# EAGLE design nrflpc (EAGLE 6.4)
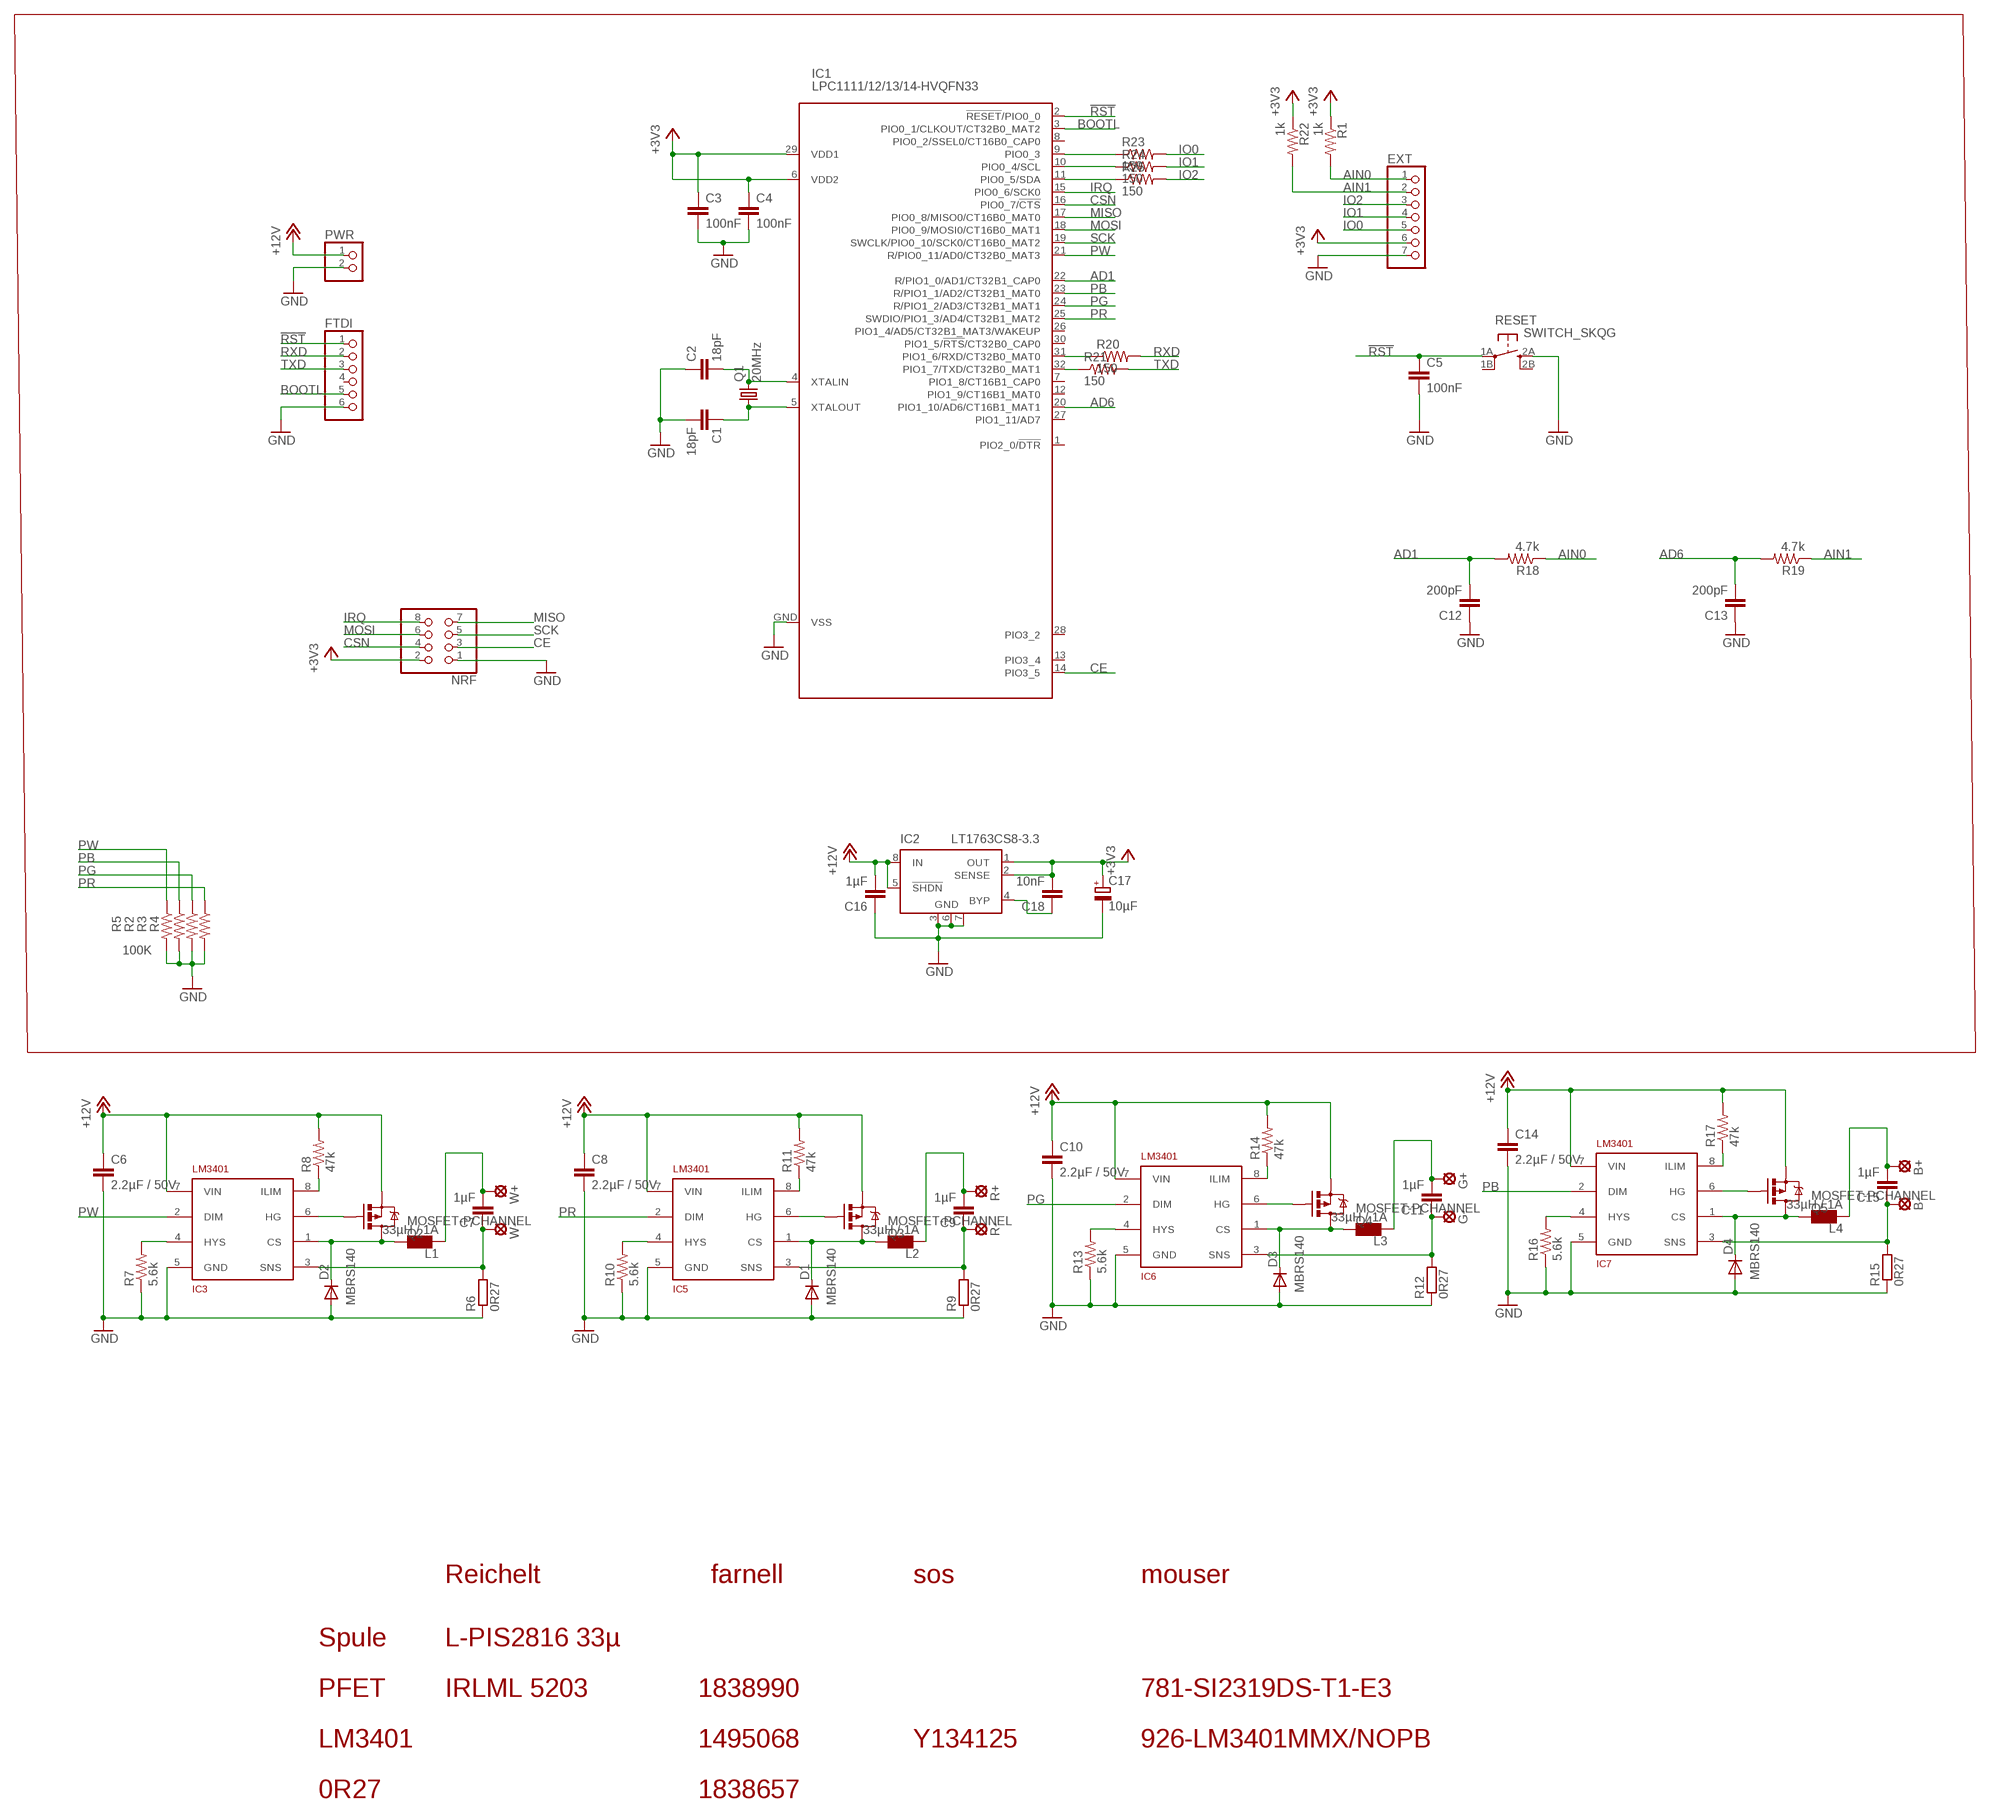
[diagram p0: schematic, sheet 1]

## Parts
B+  SE14  [SE14]
B-  SE14  [SE14]
C1  18pF  CAP0402-CAP  [0402-CAP]
C2  18pF  CAP0402-CAP  [0402-CAP]
C3  100nF  CAP0402-CAP  [0402-CAP]
C4  100nF  CAP0402-CAP  [0402-CAP]
C5  100nF  CAP0402-CAP  [0402-CAP]
C6  2.2µF / 50V  C-EUC1210  [C1210]
C7  1µF  CAP0805  [0805]
C8  2.2µF / 50V  C-EUC1210  [C1210]
C9  1µF  CAP0805  [0805]
C10  2.2µF / 50V  C-EUC1210  [C1210]
C11  1µF  CAP0805  [0805]
C12  200pF  CAP0402-CAP  [0402-CAP]
C13  200pF  CAP0402-CAP  [0402-CAP]
C14  2.2µF / 50V  C-EUC1210  [C1210]
C15  1µF  CAP0805  [0805]
C16  1µF  CAP0805  [0805]
C17  10µF  CPOL-EUSMCA  [SMC_A]
C18  10nF  CAP0402-CAP  [0402-CAP]
D1  MBRS140  DIODE-SMB  [SMB]
D2  MBRS140  DIODE-SMB  [SMB]
D3  MBRS140  DIODE-SMB  [SMB]
D4  MBRS140  DIODE-SMB  [SMB]
EXT  PINHD-1X7  [1X07]
FTDI  PINHD-1X6  [1X06]
G+  SE14  [SE14]
G-  SE14  [SE14]
IC1  LPC1111/12/13/14-HVQFN33  [HVQFN33]
IC2  LT1763CS8-3.3  [SOIC8]
IC3  LM3401  [MSOP8]
IC5  LM3401  [MSOP8]
IC6  LM3401  [MSOP8]
IC7  LM3401  [MSOP8]
L1  33µH / 1A  L_PIS2816  [PIS2816]
L2  33µH / 1A  L_PIS2816  [PIS2816]
L3  33µH / 1A  L_PIS2816  [PIS2816]
L4  33µH / 1A  L_PIS2816  [PIS2816]
NRF  PINHD-2X4  [2X04]
PWR  PINHD-1X2  [1X02]
Q1  20MHz  MT-OSCILLATOR  [MT]
Q2  MOSFET-PCHANNEL  [SOT23]
Q3  MOSFET-PCHANNEL  [SOT23]
Q4  MOSFET-PCHANNEL  [SOT23]
Q5  MOSFET-PCHANNEL  [SOT23]
R1  1k  RESISTOR0402-RES  [0402-RES]
R2  100K  RESISTOR0402-RES  [0402-RES]
R3  100K  RESISTOR0402-RES  [0402-RES]
R4  100K  RESISTOR0402-RES  [0402-RES]
R5  100K  RESISTOR0402-RES  [0402-RES]
R6  0R27  R-EU_R1206  [R1206]
R7  5.6k  RESISTOR0805-RES  [0805]
R8  47k  RESISTOR0805-RES  [0805]
R9  0R27  R-EU_R1206  [R1206]
R10  5.6k  RESISTOR0805-RES  [0805]
R11  47k  RESISTOR0805-RES  [0805]
R12  0R27  R-EU_R1206  [R1206]
R13  5.6k  RESISTOR0805-RES  [0805]
R14  47k  RESISTOR0805-RES  [0805]
R15  0R27  R-EU_R1206  [R1206]
R16  5.6k  RESISTOR0805-RES  [0805]
R17  47k  RESISTOR0805-RES  [0805]
R18  4.7k  RESISTOR0402-RES  [0402-RES]
R19  4.7k  RESISTOR0402-RES  [0402-RES]
R20  150  RESISTOR0402-RES  [0402-RES]
R21  150  RESISTOR0402-RES  [0402-RES]
R22  1k  RESISTOR0402-RES  [0402-RES]
R23  150  RESISTOR0402-RES  [0402-RES]
R24  150  RESISTOR0402-RES  [0402-RES]
R25  150  RESISTOR0402-RES  [0402-RES]
R+  SE14  [SE14]
R-  SE14  [SE14]
RESET  SWITCH_SKQG  [SWITCH_SKQG]
W+  SE14  [SE14]
W-  SE14  [SE14]

## Nets
!RST: C5.1 FTDI.1 IC1.2(!RESET!/PIO0_0) RESET.1A
+3V3: C3.1 C4.1 C17.+ C18.2 EXT.6 IC1.6(VDD2) IC1.29(VDD1) IC2.1(OUT) IC2.2(SENSE) NRF.2 R1.1 R22.1
+12V: C6.1 C8.1 C10.1 C14.1 C16.2 IC2.5(!SHDN) IC2.8(IN) IC3.7(VIN) IC5.7(VIN) IC6.7(VIN) IC7.7(VIN) PWR.1 Q2.2(S) Q3.2(S) Q4.2(S) Q5.2(S) R8.2 R11.2 R14.2 R17.2
AD1: C12.2 IC1.22(R/PIO1_0/AD1/CT32B1_CAP0) R18.2
AD6: C13.2 IC1.20(PIO1_10/AD6/CT16B1_MAT1) R19.2
AIN0: EXT.1 R1.2 R18.1
AIN1: EXT.2 R19.1 R22.2
BOOTL: FTDI.5 IC1.3(PIO0_1/CLKOUT/CT32B0_MAT2)
CE: IC1.14(PIO3_5) NRF.3
CSN: IC1.16(PIO0_7/!CTS!) NRF.4
GND: C1.2 C2.1 C3.2 C4.2 C5.2 C6.2 C8.2 C10.2 C12.1 C13.1 C14.2 C16.1 C17.- D1.A D2.A D3.A D4.A EXT.7 FTDI.6 IC1.GND(VSS) IC2.3(GND) IC2.6(GND) IC2.7(GND) IC3.5(GND) IC5.5(GND) IC6.5(GND) IC7.5(GND) NRF.1 PWR.2 R2.2 R3.2 R4.2 R5.2 R6.1 R7.1 R9.1 R10.1 R12.1 R13.1 R15.1 R16.1 RESET.2A
IO0: EXT.5 R23.2
IO1: EXT.4 R24.2
IO2: EXT.3 R25.2
IRQ: IC1.15(PIO0_6/SCK0) NRF.8
MISO: IC1.17(PIO0_8/MISO0/CT16B0_MAT0) NRF.7
MOSI: IC1.18(PIO0_9/MOSI0/CT16B0_MAT1) NRF.6
N$1: C7.1 IC3.3(SNS) R6.2 W-.MP
N$2: C7.2 L1.P$2 W+.MP
N$3: D2.C IC3.1(CS) L1.P$1 Q2.3(D)
N$4: C9.1 IC5.3(SNS) R9.2 R-.MP
N$5: IC3.4(HYS) R7.2
N$6: C9.2 L2.P$2 R+.MP
N$7: IC3.8(ILIM) R8.1
N$8: D1.C IC5.1(CS) L2.P$1 Q3.3(D)
N$9: IC5.4(HYS) R10.2
N$10: IC3.6(HG) Q2.1(G)
N$11: IC5.8(ILIM) R11.1
N$12: IC5.6(HG) Q3.1(G)
N$13: C11.1 G-.MP IC6.3(SNS) R12.2
N$14: C11.2 G+.MP L3.P$2
N$15: D3.C IC6.1(CS) L3.P$1 Q4.3(D)
N$16: IC6.4(HYS) R13.2
N$17: IC6.8(ILIM) R14.1
N$18: C18.1 IC2.4(BYP)
N$19: C2.2 IC1.4(XTALIN) Q1.3
N$20: IC6.6(HG) Q4.1(G)
N$21: B-.MP C15.1 IC7.3(SNS) R15.2
N$22: B+.MP C15.2 L4.P$2
N$23: D4.C IC7.1(CS) L4.P$1 Q5.3(D)
N$24: IC7.4(HYS) R16.2
N$25: IC7.8(ILIM) R17.1
N$26: IC7.6(HG) Q5.1(G)
N$27: IC1.31(PIO1_6/RXD/CT32B0_MAT0) R20.1
N$29: C1.1 IC1.5(XTALOUT) Q1.1
N$30: IC1.32(PIO1_7/TXD/CT32B0_MAT1) R21.1
N$34: IC1.9(PIO0_3) R23.1
N$35: IC1.10(PIO0_4/SCL) R24.1
N$36: IC1.11(PIO0_5/SDA) R25.1
PB: IC1.23(R/PIO1_1/AD2/CT32B1_MAT0) IC7.2(DIM) R2.1
PG: IC1.24(R/PIO1_2/AD3/CT32B1_MAT1) IC6.2(DIM) R3.1
PR: IC1.25(SWDIO/PIO1_3/AD4/CT32B1_MAT2) IC5.2(DIM) R4.1
PW: IC1.21(R/PIO0_11/AD0/CT32B0_MAT3) IC3.2(DIM) R5.1
RXD: FTDI.2 R20.2
SCK: IC1.19(SWCLK/PIO0_10/SCK0/CT16B0_MAT2) NRF.5
TXD: FTDI.3 R21.2
Unconnected: FTDI.4 IC1.1(PIO2_0/!DTR!) IC1.7(PIO1_8/CT16B1_CAP0) IC1.8(PIO0_2/SSEL0/CT16B0_CAP0) IC1.12(PIO1_9/CT16B1_MAT0) IC1.13(PIO3_4) IC1.26(PIO1_4/AD5/CT32B1_MAT3/WAKEUP) IC1.27(PIO1_11/AD7) IC1.28(PIO3_2) IC1.30(PIO1_5/!RTS!/CT32B0_CAP0) RESET.1B RESET.2B

## Notes on the sheet
- Reichelt | farnell | sos | mouser
- Spule | L-PIS2816 33µ
- PFET | IRLML 5203 | 1838990 | 781-SI2319DS-T1-E3
- LM3401 | 1495068 | Y134125 | 926-LM3401MMX/NOPB
- 0R27 | 1838657

## Library data of the parts
B+ B- G+ G- R+ R- W+ W- = solpad:SE14: SOLDER PAD E1553, drill 1,4mm, distributor Buerklin, 07F820
C1-C5 C12 C13 = SparkFun-Passives:CAP: Capacitor Standard 0603 ceramic capacitor, and 0.1" leaded capacitor.
C6 C8 C10 C14 = rcl:C-EU: CAPACITOR, European symbol
C7 C9 C11 C15 C16 C18 = SparkFun:CAP: Capacitor Standard 0603 ceramic capacitor, and 0.1" leaded capacitor.
C17 = rcl:CPOL-EU: POLARIZED CAPACITOR, European symbol
D1-D4 = diode:DIODE-: DIODE
EXT = pinhead:PINHD-1X7: PIN HEADER
FTDI = pinhead:PINHD-1X6: PIN HEADER
IC1 = lpc1100v1.1:LPC1111/12/13/14-HVQFN33: NXP Semiconductors LPC11xx microcontrollers <http://ics.nxp.com/products/lpc1000/lpc11xx/> ARM 32-bit Cortex-M0 Microcontroller with MPU CPU clock up to 50MHz Up to 32KByte on-chip Flash ROM with In-System Programming (ISP) and In-Application Programming (IAP) via On-Chip Bootloader Up to 8KByte SRAM Nested Vectored Interrupt Controller Up to 2 SPI controllers UART with full Modem Interface and RS485 Support Fast Mode I2C-Bus 4 Timers with 4 capture channels and 13 output channels Watchdog (WDT) Sytem tick timer 10-bit ADC with 8 channels Power Management Unit (PMU) Brownout detection 12MHz internal RC oscillator Serial Wire Debug/Trace port
IC2 = linear-technology:LT1763CS8: 500mA, Low Noise, LDO Micropower Regulators Source: http://cds.linear.com/docs/Datasheet/1763ff.pdf; MPN: LT1763CS8-3.3; OC_FARNELL: 1273617; OC_NEWARK: 57M6055
IC3 IC5-IC7 = seb:LM3401
L1-L4 = seb:L_PIS2816
NRF = pinhead:PINHD-2X4: PIN HEADER
PWR = pinhead:PINHD-1X2: PIN HEADER
Q1 = seb:MT-OSCILLATOR
Q2-Q5 = SparkFun:MOSFET-PCHANNEL
R1-R5 R18-R25 = SparkFun-Resistors:RESISTOR: Resistor Basic schematic elements and footprints for 0603, 1206, and PTH resistors.
R6 R9 R12 R15 = rcl:R-EU_: RESISTOR, European symbol
R7 R8 R10 R11 R13 R14 R16 R17 = SparkFun:RESISTOR: Resistor Basic schematic elements and footprints for 0603, 1206, and PTH resistors.
RESET = seb:SWITCH_SKQG

## Net classes
2 GND/3V3: width 0.2 mm, drill 0.4 mm

## Board
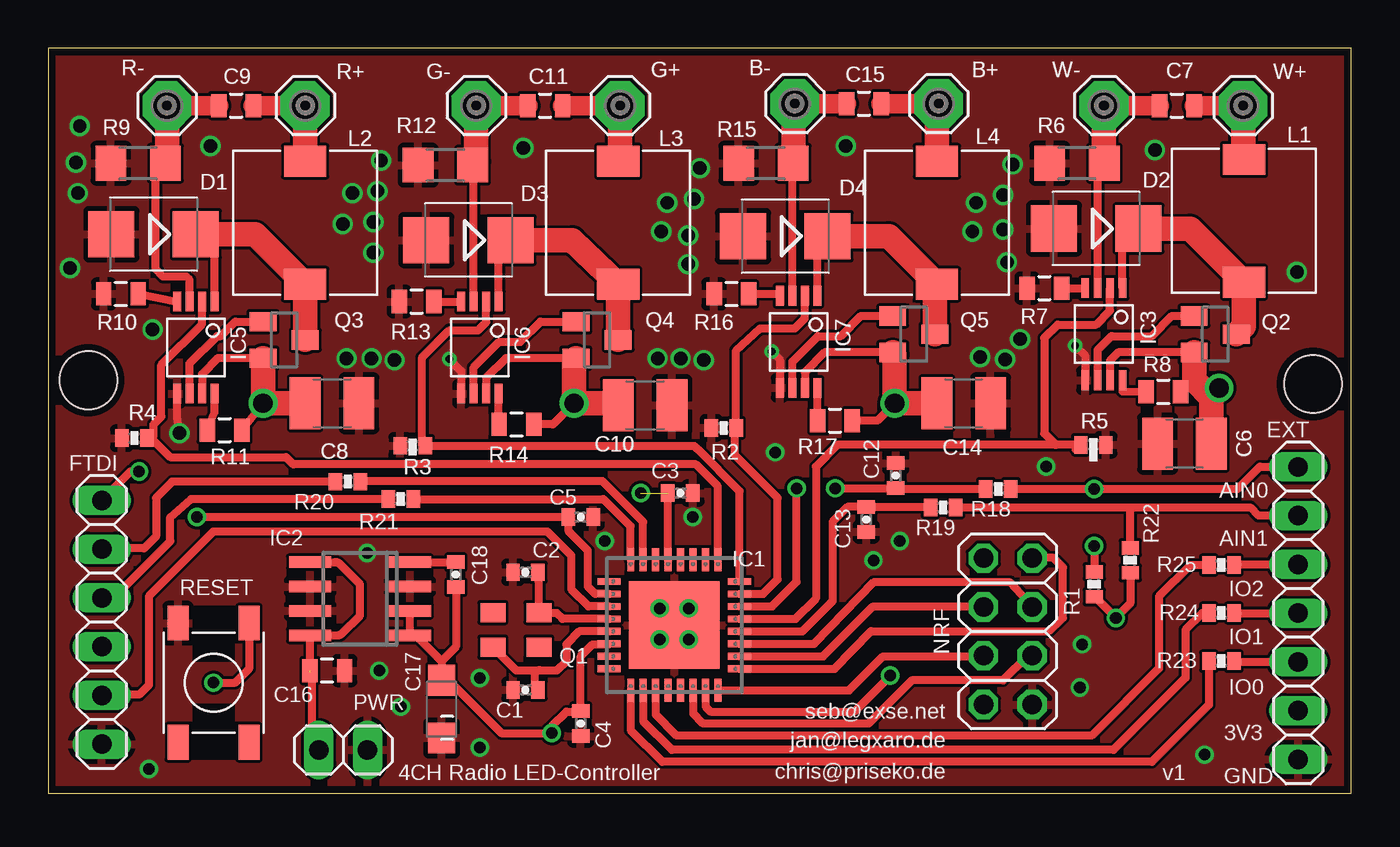
[diagram p1: board, top side]
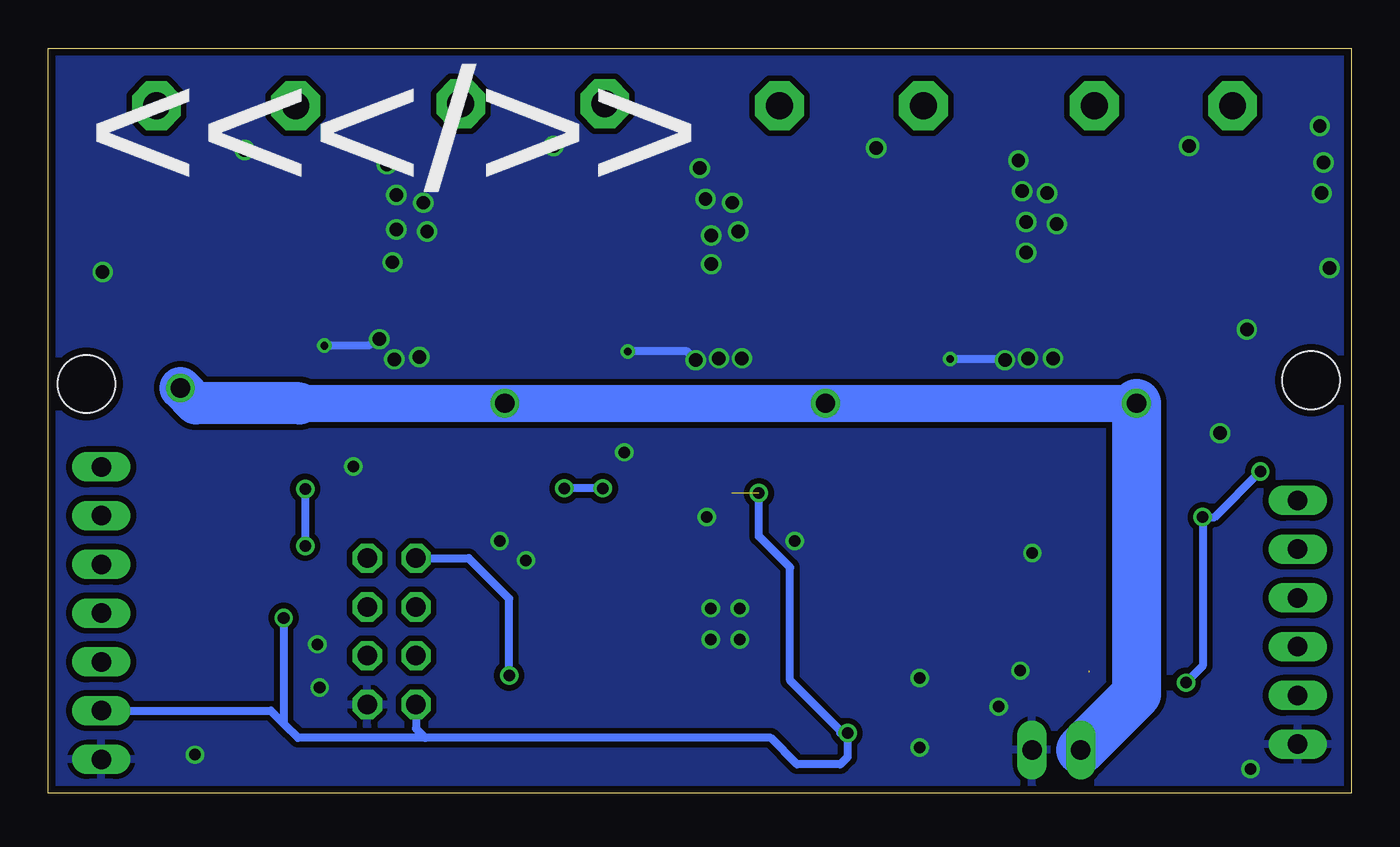
[diagram p2: board, bottom side, seen from below]

Size 67.9 x 38.8 mm. Coordinates in mm from the lower left corner, seen from the top.
Outline: 0,0 67.9,0 67.9,38.8 0,38.8 0,0
Copper layers (1*16): Top 0.0356mm / dielectric 1.5011mm / Bottom 0.0356mm
Design rules "LaenPCBOrder": minimum track width 6mil, minimum drill 13mil, track to track 6mil, track to pad 6mil, pad to pad 6mil, via to via 6mil, smd to smd 6mil, copper to edge 15mil, drill to drill 6mil, minimum pad ring 7mil, minimum via ring 7mil, stop-mask expansion 4mil, vias tented up to drill 0mil, thermal gap 10mil
Holes 3 mm at 2.1,21.5 65.9,21.3

### Footprints (pad centres in the part's own frame; a part is rotated, then mirrored left to right if it is on the bottom)
SE14 = drill 1.397 pad 2.54 octagon: MP 0,0
0402-CAP = smd 0.7 x 0.9: 1 -0.65,0; 2 0.65,0
C1210 = smd 1.6 x 2.7: 1 -1.4,0; 2 1.4,0
0805 = smd 0.8 x 1.2: 1 -0.9,0; 2 0.9,0
SMC_A = smd 1.6 x 1.4: + -1.5,0; - 1.5,0
SMB = smd 2.4 x 2.4: A 2.2,0; C -2.2,0
1X07 = drill 1.016 long: 1 -7.62,0; 2 -5.08,0; 3 -2.54,0; 4 0,0; 5 2.54,0; 6 5.08,0; 7 7.62,0
1X06 = drill 1.016 long: 1 -6.35,0; 2 -3.81,0; 3 -1.27,0; 4 1.27,0; 5 3.81,0; 6 6.35,0
HVQFN33 = smd 1.2 x 0.35: 1 -3.4,2.275; 2 -3.4,1.625; 3 -3.4,0.975; 4 -3.4,0.325; 5 -3.4,-0.325; 6 -3.4,-0.975; 7 -3.4,-1.625; 8 -3.4,-2.275; 17 3.4,-2.275; 18 3.4,-1.625; 19 3.4,-0.975; 20 3.4,-0.325; 21 3.4,0.325; 22 3.4,0.975; 23 3.4,1.625; 24 3.4,2.275 | smd 0.35 x 1.2: 9 -2.275,-3.4; 10 -1.625,-3.4; 11 -0.975,-3.4; 12 -0.325,-3.4; 13 0.325,-3.4; 14 0.975,-3.4; 15 1.625,-3.4; 16 2.275,-3.4; 25 2.275,3.4; 26 1.625,3.4; 27 0.975,3.4; 28 0.325,3.4; 29 -0.325,3.4; 30 -0.975,3.4; 31 -1.625,3.4; 32 -2.275,3.4 | smd 4.7 x 4.55: GND 0,0
SOIC8 = smd 0.6 x 2.2: 1 -1.905,-2.6; 2 -0.635,-2.6; 3 0.635,-2.6; 4 1.905,-2.6; 5 1.905,2.6; 6 0.635,2.6; 7 -0.635,2.6; 8 -1.905,2.6
MSOP8 = smd 0.41 x 1.02: 1 -0.975,-2.4; 2 -0.325,-2.4; 3 0.325,-2.4; 4 0.975,-2.4; 5 0.975,2.4; 6 0.325,2.4; 7 -0.325,2.4; 8 -0.975,2.4
PIS2816 = smd 2.2 x 1.6: P$1 0,3.2; P$2 0,-3.2
2X04 = drill 1.016 octagon: 1 -3.81,-1.27; 2 -3.81,1.27; 3 -1.27,-1.27; 4 -1.27,1.27; 5 1.27,-1.27; 6 1.27,1.27; 7 3.81,-1.27; 8 3.81,1.27
1X02 = drill 1.016 long: 1 -1.27,0; 2 1.27,0
MT = smd 1.3 x 1: 1 1.2,0.9; 2 -1.2,0.9; 3 -1.2,-0.9; 4 1.2,-0.9
SOT23 = smd 1 x 1.4: 1 -0.95,-1.1; 2 0.95,-1.1; 3 0,1.1
0402-RES = smd 0.7 x 0.9: 1 -0.65,0; 2 0.65,0
R1206 = smd 1.6 x 1.803: 1 -1.422,0; 2 1.422,0
SWITCH_SKQG = smd 1.8 x 1.1: 1A -3.1,1.85; 1B 3.1,1.85; 2A -3.1,-1.85; 2B 3.1,-1.85

### Placement (x,y rotation side)
B+  46.4,35.9 0 top
B-  38.9,35.9 0 top
C1  24.88,5.38 180 top
C2  24.88,11.5 0 top
C3  32.94,15.62 0 top
C4  27.75,3.62 270 top
C5  27.75,14.38 0 top
C6  59.2,18.2 180 top
C7  58.8,35.8 0 top
C8  14.8,20.3 0 top
C9  9.8,35.8 0 top
C10  31.1,20.2 0 top
C11  25.9,35.8 0 top
C12  44.16,16.53 270 top
C13  42.62,14.25 90 top
C14  47.7,20.3 0 top
C15  42.5,35.9 0 top
C16  14.55,6.38 180 top
C17  20.5,4.38 270 top
C18  21.25,11.38 270 top
D1  5.5,29.1 180 top
D2  54.6,29.4 180 top
D3  21.9,28.8 180 top
D4  38.4,29 180 top
EXT  65.12,9.38 270 top
FTDI  2.8,8.9 270 top
G+  29.8,35.8 0 top
G-  22.3,35.8 0 top
IC1  32.62,8.75 0 top
IC2  16.25,10.12 90 top
IC3  55,23.9 180 top
IC5  7.7,23.2 180 top
IC6  22.5,23.2 180 top
IC7  39.1,23.5 180 top
L1  62.3,29.8 180 top
L2  13.4,29.7 180 top
L3  29.7,29.7 180 top
L4  46.3,29.7 180 top
NRF  50,8.43 90 top
PWR  15.38,2.25 0 top
Q1  24.38,8.5 180 top
Q2  60.8,23.9 270 top
Q3  12.3,23.6 270 top
Q4  28.6,23.6 270 top
Q5  45.1,23.9 270 top
R1  54.5,10.88 90 top
R2  35.2,19.02 180 top
R3  19,18.09 180 top
R4  4.5,18.49 180 top
R5  54.45,18.13 0 top
R6  53.6,32.8 0 top
R7  51.9,26.3 0 top
R8  58.1,20.9 0 top
R9  4.7,32.8 0 top
R10  3.8,26 0 top
R11  9.2,18.9 0 top
R12  20.7,32.7 0 top
R13  19.2,25.6 0 top
R14  24.4,19.2 0 top
R15  37.4,32.8 0 top
R16  35.6,26 0 top
R17  41,19.4 0 top
R18  49.5,15.84 180 top
R19  46.62,14.88 180 top
R20  15.62,16.22 180 top
R21  18.38,15.31 180 top
R22  56.38,12.12 90 top
R23  61.12,6.88 0 top
R24  61.12,9.38 0 top
R25  61.12,11.88 0 top
R+  13.4,35.8 0 top
R-  6.2,35.8 0 top
RESET  8.62,5.75 270 top
W+  62.25,35.8 0 top
W-  55,35.8 0 top

### Tracks (layer width: path | path; a pad name or v marks a point on that pad's centre or on a via)
!RST  (via drill 0.6)
  Top 0.406: IC1.2 28.5,10.38 28.12,10.75 28.12,12.62 27.12,13.62 27.12,14.35 C5.1 v7.75,14.38 | v4.75,16.75 4.3,16.75 FTDI.1 | v8.62,5.75 9.75,5.75 10.47,6.47 RESET.1A
  Bottom 0.406: v4.75,16.75 7.12,14.38 v7.75,14.38 7.75,6.62 v8.62,5.75
+3V3  (via drill 0.6 pad 0.41)  (1 unrouted)
  Top 0.406: IC1.6 29.2,7.75 28.38,7.75 27.75,7.12 C4.1 27.73,4.25 27,4.25 26.25,3.5 v26.25,3.12 23.62,3.12 20.88,5.88 C17.+ 20.5,6.88 | IC2.2 IC2.1 18.88,8.2 19.18,8.2 20.5,6.88 | 32.29,12.18 arc45 IC1.29 C3.1 | C18.2 21.25,7.62 20.5,6.88 | R1.1 54.52,10.22 v55.62,9.12 56.38,9.88 R22.1
  Bottom 0.305: v26.25,3.12 26.62,3.12
  Bottom 0.406: 30.62,15.62 v30.88,15.62 30.88,13.38 29.25,11.75 29.25,5.88 26.62,3.25 26.62,3.12 | v26.25,3.12 26.25,1.88 26.62,1.5 28.88,1.5 30.25,2.88 48.25,2.88 | 48.25,2.88 54.88,2.88 55.62,3.62 | NRF.2 48.73,3.35 48.25,2.88 | v55.62,9.12 55.62,3.62 | EXT.6 56.3,4.29 55.62,3.62
+12V  (via drill 1)  (1 unrouted)
  Top 0.406: IC5.7 8.03,21.82 8.85,22.65 Q3.2 | IC6.7 22.82,21.62 23.85,22.65 Q4.2 | IC7.7 39.42,21.93 40.45,22.95 Q5.2 | IC3.7 55.33,22.52 55.75,22.95 Q2.2 | R17.2 43.2,19.4 v44.1,20.3 | R14.2 26.3,19.2 v27.4,20.3 | v11.2,20.3 R11.2 | C16.2 IC2.8 15.09,8.22 arc45 15.31,8.31 16.25,9.25 16.25,10.88 15.19,11.94 arc45 14.96,12.03 IC2.5 | 13.65,6.29 13.74,6.29 13.74,2.62 PWR.1
  Top 0.61: R8.2 59.7,21.6 59.7,21.8
  Top 1.27: C8.1 v11.2,20.3 Q3.2 | C10.1 29.6,20.3 v27.4,20.3 27.4,22.55 Q4.2 | C14.1 v44.1,20.3 44.1,22.85 Q5.2 | 60.6,20.6 C6.1 | 60.6,20.6 59.7,21.5 59.7,21.8 Q2.2 | 60.6,20.6 61,21 v61,21.1
  Bottom 1.93: 54.8,20.3 v44.1,20.3 v27.4,20.3 v11.2,20.3
  Bottom 2.184: 54.8,20.3 60.2,20.3 v61,21.1
  Bottom 2.54: v11.2,20.3 11.2,5.16 PWR.1
AD1  (via drill 0.6)
  Top 0.406: IC1.22 37.73,9.72 39,11 v39,15.88 | v41,15.88 42.48,15.88 C12.2 44.45,15.85 R18.2
  Bottom 0.406: v39,15.88 v41,15.88
AD6
  Top 0.406: IC1.20 39.3,8.43 40.88,10 40.88,14.12 41.65,14.9 C13.2 45.95,14.9 R19.2
AIN0  (via drill 0.6)
  Top 0.406: R18.1 v54.5,15.84 61.97,15.84 63.12,17 EXT.1 | v54.5,12.88 R1.2
  Bottom 0.406: v54.5,15.84 v54.5,12.88
AIN1
  Top 0.406: R19.1 56.25,14.88 | 56.25,14.88 62.62,14.88 63.05,14.46 EXT.2 | R22.2 56.38,14.75 56.25,14.88
BOOTL
  Top 0.406: IC1.3 28.15,9.72 27.25,10.62 27.25,12.38 26,13.62 8.62,13.62 5.25,10.25 5.25,5.62 4.75,5.12 2.83,5.12 FTDI.5
CE
  Top 0.406: NRF.3 51.03,7.16 49.75,5.88 45,5.88 42.75,3.62 34.12,3.62 33.6,4.15 IC1.14
CSN
  Top 0.406: IC1.16 41.73,5.35 43.5,7.12 48.7,7.12 NRF.4
GND  (via drill 0.4, 0.6, 0.6 pad 0.41, 0.7)
  Top 0.406: IC5.5 6.72,19.57 v6.85,18.74 | IC3.5 54.02,22.77 v53.5,23.3 | IC7.5 38.12,22.57 v37.7,23 | IC6.5 21.52,21.98 v20.9,22.6 | IC1.GND 31.88,8.75 v31.88,8
  Bottom 0.406: v53.5,23.3 51.2,23.3 v50.64,23.64 | v37.7,23 34.61,23 v34.15,22.54 | v20.9,22.6 18.11,22.6 v18.05,22.54
  other vias: 57.66,33.5 49.85,22.59 48.56,22.71 32.95,22.64 31.75,22.64 15.55,22.64 16.85,22.64 16.95,28.14 16.95,29.74 17.15,31.34 17.35,32.94 1.15,27.34 1.55,31.24 1.45,32.84 1.65,34.74 49.95,27.64 49.75,29.34 49.75,31.14 50.25,32.74 33.35,27.54 33.35,29.04 33.65,30.94 33.95,32.54 15.35,29.64 15.85,31.24 31.95,29.24 32.25,30.74 48.15,29.24 48.35,30.74 65.05,27.14 41.56,33.7 24.76,33.6 8.46,33.7 5.45,24.14 31.88,9.62 33.38,9.62 33.38,8 22.5,6 33.59,14.38 29,13.12 18.38,4.5 17.25,6.38 22.5,2.38 5.25,1.25 60.25,2 53.88,7.75 53.75,5.5 44.38,13.12 43,12.12 37.88,17.75 52,17 16.62,12.5
  pour Bottom (isolate 0.305, rank 2): 0.04,38.78 -0.15,0 67.64,0 67.88,38.78
  pour Top: 67.9,0 67.8,38.7 0,38.7 -0.12,0
IO0
  Top 0.406: R23.2 arc45 61.87,6.83 EXT.5
IO1
  Top 0.406: R24.2 EXT.4
IO2
  Top 0.406: R25.2 arc-45 61.87,11.91 EXT.3
IRQ  (via drill 0.6)
  Top 0.406: IC1.15 34.25,4.5 34.5,4.25 42,4.25 v43.88,6.12
  Bottom 0.406: v43.88,6.12 43.88,10.12 45.98,12.23 NRF.8
MISO
  Top 0.406: IC1.17 40.98,6.47 42.88,8.44 52.12,8.44 52.88,9.12 52.88,11.75 52.38,12.25 51.28,12.25 NRF.7
MOSI
  Top 0.406: IC1.18 40.38,7.12 42.95,9.7 NRF.6
N$1
  Top 0.406: IC3.3 54.67,32.35 R6.2
  Top 1.016: W-.MP C7.1
  Top 1.27: W-.MP 55,32.82 R6.2
N$2
  Top 1.016: W+.MP C7.2
  Top 1.27: W+.MP 62.25,33.05 L1.P$2
N$3
  Top 0.406: IC3.1 55.98,28.68 D2.C
  Top 1.27: D2.C 59.5,29.4 L1.P$1 62.3,24.3 Q2.3
N$4
  Top 0.406: 5.88,32.55 R9.2 5.6,32.28 5.6,27.3 6,26.9 7.2,26.9 7.38,26.73 IC5.3
  Top 1.016: R-.MP C9.1
  Top 1.27: R9.2 6.2,32.88 R-.MP
N$5
  Top 0.406: R7.2 IC3.4
N$6
  Top 1.016: R+.MP C9.2
  Top 1.27: L2.P$2 R+.MP
N$7
  Top 0.406: IC3.8 55.98,20.93 R8.1
N$8
  Top 0.406: IC5.1 8.68,28.68 D1.C
  Top 1.27: D1.C 10.8,29.1 L2.P$1 Q3.3
N$9
  Top 0.406: R10.2 IC5.4
N$10
  Top 0.406: IC3.6 54.67,23.07 55.4,23.8 57.5,23.8 58.55,24.85 Q2.1
N$11
  Top 0.406: IC5.8 8.68,19.82 R11.1
N$12
  Top 0.406: IC5.6 7.38,22.38 8.8,23.8 9,23.8 9.75,24.55 Q3.1
N$13
  Top 0.406: IC6.3 22.18,32.25 R12.2
  Top 1.016: G-.MP C11.1
  Top 1.27: R12.2 22.3,32.88 G-.MP
N$14
  Top 1.016: G+.MP C11.2
  Top 1.27: L3.P$2 29.8,32.9 G+.MP
N$15
  Top 0.406: IC6.1 23.48,28.27 D3.C
  Top 1.27: D3.C 27.3,28.8 L3.P$1 Q4.3
N$16
  Top 0.406: R13.2 IC6.4
N$17
  Top 0.406: IC6.8 23.48,19.23 R14.1
N$18
  Top 0.406: IC2.4 C18.1
N$19
  Top 0.406: IC1.4 26.8,9.07 26.5,9.38 25.6,9.38 Q1.3 25.57,10.82 C2.2
N$20
  Top 0.406: IC6.6 22.18,22.18 23.5,23.5 24.6,23.5 25.65,24.55 Q4.1
N$21
  Top 0.406: IC7.3 38.77,32.05 R15.2
  Top 1.016: B-.MP C15.1
  Top 1.27: B-.MP 38.82,35.82 R15.2
N$22
  Top 1.016: B+.MP C15.2
  Top 1.27: B+.MP 46.3,35.8 L4.P$2
N$23
  Top 0.406: IC7.1 40.08,28.38 D4.C
  Top 1.27: D4.C 43.8,29 L4.P$1 46.2,26.4 Q5.3
N$24
  Top 0.406: R16.2 37.92,26 IC7.4
N$25
  Top 0.406: IC7.8 40.08,19.43 R17.1
N$26
  Top 0.406: IC7.6 38.77,22.48 40.1,23.8 41.3,23.8 42.35,24.85 Q5.1
N$27
  Top 0.406: IC1.31 31,14.12 28.88,16.25 16.31,16.25 R20.1
N$29
  Top 0.406: IC1.5 27.68,8.43 27,7.75 27,6.88 26.5,6.38 25.62,6.38 | 25.62,6.38 25.38,6.38 | 25.38,6.38 24.4,6.38 Q1.1 | 25.6,6.4 25.62,6.38 | C1.1 arc-90 25.38,5.53 25.38,6.38
N$30
  Top 0.406: R21.1 28.94,15.31 30.35,13.9 IC1.32
N$34
  Top 0.406: IC1.9 30.35,3.27 32,1.62 57.5,1.62 60.48,4.6 R23.1
N$35
  Top 0.406: IC1.10 31,3.75 32.5,2.25 55.5,2.25 59.25,6 59.25,8.5 60.12,9.38 R24.1
N$36
  Top 0.406: IC1.11 31.65,4.1 32.75,3 52.62,3 53.25,3 54.38,3 57.88,6.5 57.88,10.25 59.5,11.88 R25.1
PB
  Top 0.406: IC7.2 39.42,24.73 38.9,24.2 37.1,24.2 35.85,23.05 R2.1 35.75,19.02 35.75,17.62 38,15.38 38,11.12 37.25,10.38 IC1.23
PG
  Top 0.406: IC6.2 22.82,24.52 22.4,24.1 20.9,24.1 19.5,22.7 19.5,18.11 R3.1 33.66,18.09 33.79,17.96 33.88,17.88 36.02,15.72 IC1.24
PR
  Top 0.406: IC5.2 8.03,24.43 5.9,22.3 5.9,19.6 5.5,19.2 5.5,18.6 5.15,18.25 R4.1 5.39,18.49 6.38,17.5 12.4,17.5 12.78,17.12 33.75,17.12 34.9,15.97 IC1.25
PW
  Top 0.406: IC3.2 55.33,25.12 54.6,24.4 52.6,24.4 51.9,23.7 51.9,18.73 52.5,18.13 | 53.54,17.9 R5.1 52.5,18.13 | 52.5,18.13 41.13,18.13 40,17 40,10.13 38.94,9.07 IC1.21
RXD
  Top 0.406: R20.2 6.47,16.22 5.62,15.38 5.62,13.38 5,12.75 2.84,12.75 FTDI.2
SCK
  Top 0.406: NRF.5 51.27,9.73 50.12,10.97 43,10.97 39.9,7.78 IC1.19
TXD
  Top 0.406: R21.2 7.44,15.31 6.38,14.38 6.38,13.12 3.42,10.17 FTDI.3

### Text on the board
tPlace: AIN0 | AIN1 | IO2 | IO1 | seb@exse.net | IO0 | jan@legxaro.de | 3V3 | chris@priseko.de | 4CH Radio LED-Controller | v1 | GND
tNames: Q1
bNames: <<</>>
_tNames: R- | C9 | R+ | G- | C11 | G+ | B- | C15 | B+ | W- | C7 | W+ | L1 | R9 | L2 | R12 | L3 | R15 | L4 | R6 | D1 | D3 | D4 | D2 | IC7 | IC3 | R10 | IC5 | Q3 | R13 | IC6 | Q4 | R16 | Q5 | R7 | Q2 | R8 | R5 | R4 | C10 | R17 | C14 | R11 | C8 | R3 | R14 | R2 | C6
_tValues: SE14 | SE14 | SE14 | SE14 | SE14 | SE14 | SE14 | SE14 | 33µH / 1A | 33µH / 1A | 1µF | 33µH / 1A | 33µH / 1A | 1µF | 1µF | 1µF | MBRS140 | MBRS140 | MBRS140 | MBRS140 | 0R27 | 0R27 | 0R27 | 0R27 | LM3401 | LM3401 | 5.6k | LM3401 | MOSFET-PCHANNEL | LM3401 | MOSFET-PCHANNEL | 5.6k | MOSFET-PCHANNEL | 5.6k | MOSFET-PCHANNEL | 5.6k | 2.2µF / 50V | 47k | 47k | 47k | 47k | 2.2µF / 50V | 2.2µF / 50V | 2.2µF / 50V | RJ45-8L-B | 100K | 78L05SMD | MEGA48/88/168-AU | 1µF | RJ45-8L-B | 100nF